# Altium schematic sheet P16 System RST.SchDoc
size 420 x 297 mm
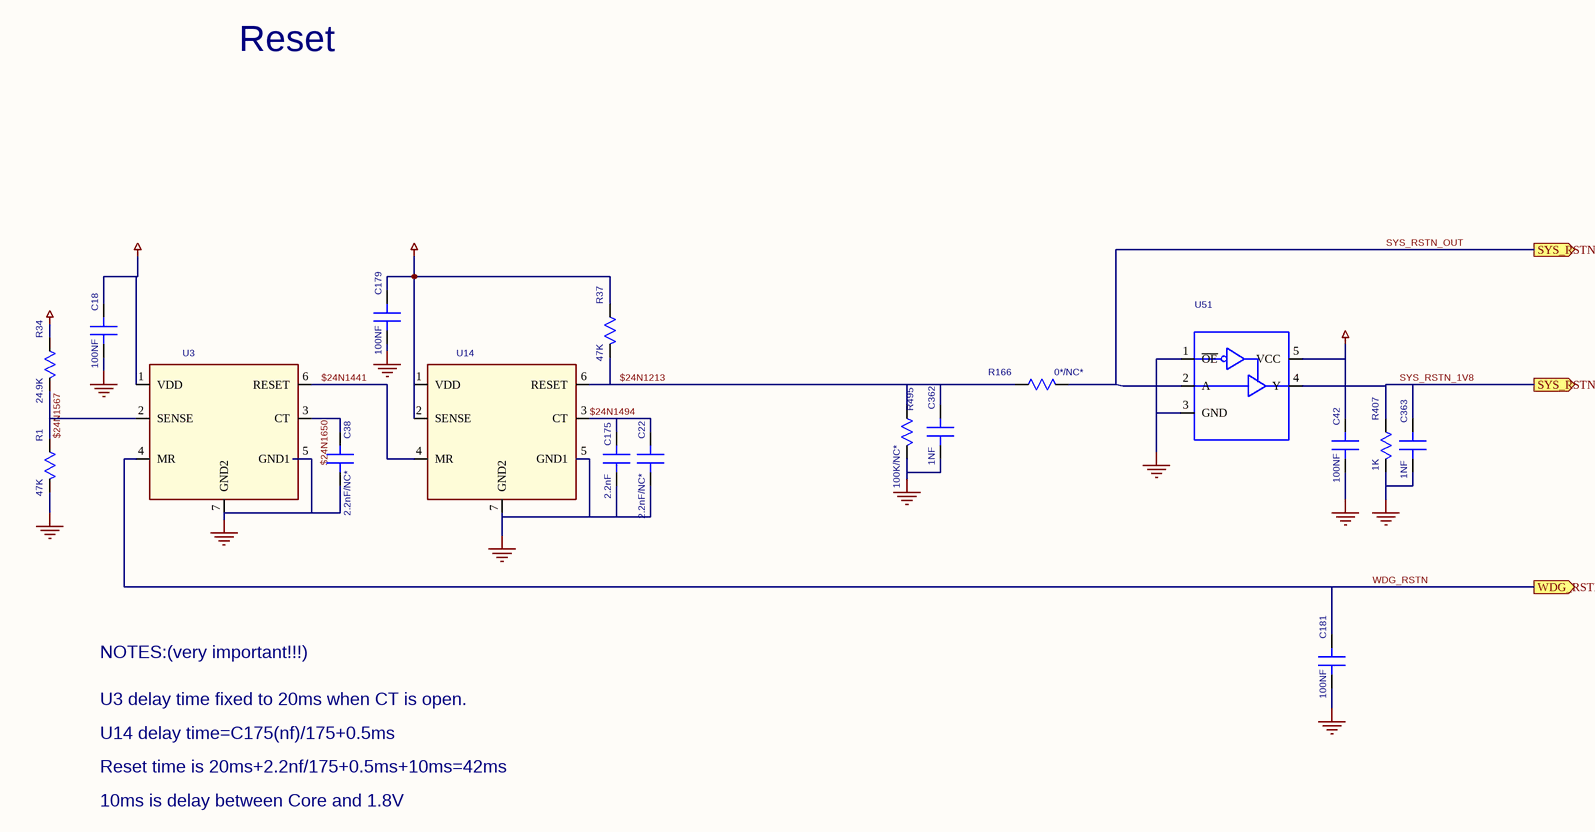
[diagram p0: P16 System RST.SchDoc]

## Parts
C18  100NF  [SC0402]
C22  2.2nF/NC*  [SC0402]
C38  2.2nF/NC*  [SC0402]
C42  100NF  [SC0402]
C175  2.2nF  [SC0402]
C179  100NF  [SC0402]
C181  100NF  [SC0402]
C362  1NF  [SC0402]
C363  1NF  [SC0402]
R1  47K  [SR0402]
R34  24.9K  [SR0402]
R37  47K  [SR0402]
R166  0*/NC*  [SR0402]
R407  1K  [SR0402]
R495  100K/NC*  [SR0402]
U3  *  [WDFN6-0R65-2X2-H1R6X1R00]  (value not drawn)
U14  *  [WDFN6-0R65-2X2-H1R6X1R00]  (value not drawn)
U51  SN74LVC1G125Q-Q1  [HSOT-SC70-DCK]  (value not drawn)

## Ports
SYS_RSTN_1V8, SYS_RSTN_OUT (out), WDG_RSTN (out)

## Nets
1V8: C18.1(A) C42.1(A) C179.1(A) R37.1(A) U3.1(VDD) U14.1(VDD) U14.2(SENSE) U51.5(VCC)
DVDD: R34.1(A)
GND: C18.2(B) C22.2(B) C38.2(B) C42.2(B) C175.2(B) C179.2(B) C181.2(B) C362.2(B) C363.2(B) R1.2(B) R407.2(B) R495.2(B) U3.5(GND1) U3.7(GND2) U14.5(GND1) U14.7(GND2) U51.1(~{OE}) U51.3(GND)
$24N1213: C362.1(A) R37.2(B) R166.1(A) R495.1(A) U14.6(RESET)
$24N1441: U3.6(RESET) U14.4(MR)
$24N1494: C22.1(A) C175.1(A) U14.3(CT)
$24N1567: R1.1(A) R34.2(B) U3.2(SENSE)
$24N1650: C38.1(A) U3.3(CT)
SYS_RSTN_1V8: C363.1(A) R407.1(A) U51.4(Y) ; port SYS_RSTN_1V8
SYS_RSTN_OUT: R166.2(B) U51.2(A) ; port SYS_RSTN_OUT
WDG_RSTN: C181.1(A) U3.4(MR) ; port WDG_RSTN

## Notes on the sheet
- Reset
- U3 delay time fixed to 20ms when CT is open.
- NOTES:(very important!!!)
- Reset time is 20ms+2.2nf/175+0.5ms+10ms=42ms
- U14 delay time=C175(nf)/175+0.5ms
- 10ms is delay between Core and 1.8V

## Library data of the parts
C18 C42 = C: PARTS: 1; OriginalSymbolOrigin: (0,0); DEVICE: RMEMK105BJ104KV_FR; LEVEL: STD; PINSWAP: (A,B); %182%%238%%182%%168%%185%%164%%215%%247%%181%%231%%209%%185%(V): 16; COMPONENT_HIGH_MAX: 0.55MM; CODE: 8070614; %195%%232%%202%%246%: SMD陶瓷电容-16V-100NF-+/-10%-X7R-0402-BT; %208%%161%%192%%224%%195%%251%%179%%198%: SMD陶瓷电容; PKG_TYPE: SC0402
C22 = C: PARTS: 1; OriginalSymbolOrigin: (0,0); DEVICE: C0402C222K5RAC_7867; LEVEL: STD; PINSWAP: (A,B); CODE: 8070924; %195%%232%%202%%246%: SMD陶瓷电容-50V-2.2nF-+/-10%-X7R-0402-供电专用-08070557拆分-供电专用; %182%%238%%182%%168%%185%%164%%215%%247%%181%%231%%209%%185%(V): 50; COMPONENT_HIGH_MAX: 0.55mm; %208%%161%%192%%224%%195%%251%%179%%198%: SMD陶瓷电容; VARIANT_ID: $24I1610; PKG_TYPE: SC0402
C38 = C: PARTS: 1; OriginalSymbolOrigin: (0,0); DEVICE: C0402C222K5RAC_7867; LEVEL: STD; PINSWAP: (A,B); CODE: 8070924; %195%%232%%202%%246%: SMD陶瓷电容-50V-2.2nF-+/-10%-X7R-0402-供电专用-08070557拆分-供电专用; %182%%238%%182%%168%%185%%164%%215%%247%%181%%231%%209%%185%(V): 50; COMPONENT_HIGH_MAX: 0.55mm; %208%%161%%192%%224%%195%%251%%179%%198%: SMD陶瓷电容; VARIANT_ID: $24I1651; PKG_TYPE: SC0402
C175 = C: PARTS: 1; OriginalSymbolOrigin: (0,0); DEVICE: C0402C222K5RAC_7867; LEVEL: STD; PINSWAP: (A,B); %208%%161%%192%%224%%195%%251%%179%%198%: SMD陶瓷电容; COMPONENT_HIGH_MAX: 0.55mm; %182%%238%%182%%168%%185%%164%%215%%247%%181%%231%%209%%185%(V): 50; %195%%232%%202%%246%: SMD陶瓷电容-50V-2.2nF-+/-10%-X7R-0402-供电专用-08070557拆分-供电专用; CODE: 8070924; PKG_TYPE: SC0402
C179 = C: PARTS: 1; OriginalSymbolOrigin: (0,0); DEVICE: RMEMK105BJ104KV_FR; LEVEL: STD; PINSWAP: (A,B); %208%%161%%192%%224%%195%%251%%179%%198%: SMD陶瓷电容; %195%%232%%202%%246%: SMD陶瓷电容-16V-100NF-+/-10%-X7R-0402-BT; CODE: 8070614; COMPONENT_HIGH_MAX: 0.55MM; %182%%238%%182%%168%%185%%164%%215%%247%%181%%231%%209%%185%(V): 16; PKG_TYPE: SC0402
C181 = C: PARTS: 1; OriginalSymbolOrigin: (0,0); DEVICE: RMEMK105BJ104KV_FR; LEVEL: STD; PINSWAP: (A,B); %208%%161%%192%%224%%195%%251%%179%%198%: SMD陶瓷电容; %195%%232%%202%%246%: SMD陶瓷电容-16V-100NF-+/-10%-X7R-0402-BT; CODE: 8070614; %182%%238%%182%%168%%185%%164%%215%%247%%181%%231%%209%%185%(V): 16; COMPONENT_HIGH_MAX: 0.55MM; PKG_TYPE: SC0402
C362 = C: PARTS: 1; OriginalSymbolOrigin: (0,0); DEVICE: 04025C102KAT2A; LEVEL: STD; PINSWAP: (A,B); %208%%161%%192%%224%%195%%251%%179%%198%: SMD陶瓷电容; %195%%232%%202%%246%: SMD陶瓷电容-50V-1nF-+/-10%-X7R-0402-BT; CODE: 8070531; COMPONENT_HIGH_MAX: 0.56MM; %182%%238%%182%%168%%185%%164%%215%%247%%181%%231%%209%%185%(V): 50; PKG_TYPE: SC0402
C363 = C: PARTS: 1; OriginalSymbolOrigin: (0,0); DEVICE: 04025C102KAT2A; LEVEL: STD; PINSWAP: (A,B); %182%%238%%182%%168%%185%%164%%215%%247%%181%%231%%209%%185%(V): 50; COMPONENT_HIGH_MAX: 0.56MM; CODE: 8070531; %195%%232%%202%%246%: SMD陶瓷电容-50V-1nF-+/-10%-X7R-0402-BT; %208%%161%%192%%224%%195%%251%%179%%198%: SMD陶瓷电容; PKG_TYPE: SC0402
R1 = R_Dup1: PARTS: 1; OriginalSymbolOrigin: (0,0); PINSWAP: (A,B); DEVICE: RK73H1ELTP4702F; LEVEL: STD; CODE: 7090829; %195%%232%%202%%246%: 片式厚膜电阻器-0.0625W-47000ohm-+/-1%-0402; %182%%238%%182%%168%%185%%166%%194%%202%(W): 0.06; %215%%232%%214%%181%%212%%202%%208%%237%%198%%171%%178%%238%: +/-1%; COMPONENT_HIGH_MAX: 0.4MM; %208%%161%%192%%224%%195%%251%%179%%198%: 片式厚膜电阻器; PKG_TYPE: SR0402
R34 = R_Dup1: PARTS: 1; OriginalSymbolOrigin: (0,0); PINSWAP: (A,B); DEVICE: RC_02W2492FT; LEVEL: STD; CODE: 7091377; %195%%232%%202%%246%: 片式厚膜电阻器-0.0625W-24900ohm-+/-1%-0402; %182%%238%%182%%168%%185%%166%%194%%202%(W): 0.06; %215%%232%%214%%181%%212%%202%%208%%237%%198%%171%%178%%238%: +/-1%; COMPONENT_HIGH_MAX: 0.4mm; %208%%161%%192%%224%%195%%251%%179%%198%: 片式厚膜电阻器; PKG_TYPE: SR0402
R37 = R_Dup1: PARTS: 1; OriginalSymbolOrigin: (0,0); PINSWAP: (A,B); DEVICE: RC0402FR_0747KL; LEVEL: STD; CODE: 7091621; %195%%232%%202%%246%: 片式厚膜电阻器-0.0625W-47000ohm-+/-1%-0402--供电专用 07090829-供电专用; %182%%238%%182%%168%%185%%166%%194%%202%(W): 0.06; %215%%232%%214%%181%%212%%202%%208%%237%%198%%171%%178%%238%: +/-1%; COMPONENT_HIGH_MAX: 0.4MM; %208%%161%%192%%224%%195%%251%%179%%198%: 片式厚膜电阻器; PKG_TYPE: SR0402
R166 = R_Dup1: PARTS: 1; OriginalSymbolOrigin: (0,0); PINSWAP: (A,B); DEVICE: RC0402JR_070R; LEVEL: STD; VARIANT_ID: $24I1229; COMPONENT_HIGH_MAX: 0.4MM; CODE: 7090800; %195%%232%%202%%246%: 片式厚膜电阻器-0.0625W-0ohm-< 50mohm-0402-1A-BT; %208%%161%%192%%224%%195%%251%%179%%198%: 片式厚膜电阻器; PKG_TYPE: SR0402
R407 = R_Dup1: PARTS: 1; OriginalSymbolOrigin: (0,0); PINSWAP: (A,B); DEVICE: RC0402FR_071KL; LEVEL: STD; %208%%161%%192%%224%%195%%251%%179%%198%: 片式厚膜电阻器; %195%%232%%202%%246%: 片式厚膜电阻器-0.0625W-1000ohm-+/-1%-0402-BT; CODE: 7091282; COMPONENT_HIGH_MAX: 0.4MM; PKG_TYPE: SR0402
R495 = R_Dup1: PARTS: 1; OriginalSymbolOrigin: (0,0); PINSWAP: (A,B); DEVICE: RK73H1ETTP1003F; LEVEL: STD; VARIANT_ID: $24I871; COMPONENT_HIGH_MAX: 0.4MM; CODE: 7090875; %195%%232%%202%%246%: 片式厚膜电阻器-0.0625W-100000ohm-+/-1%-0402; %208%%161%%192%%224%%195%%251%%179%%198%: 片式厚膜电阻器; PKG_TYPE: SR0402
U3 = NCP308_2: PARTS: 1; OriginalSymbolOrigin: (0,0); LEVEL: STD; HETERO: NCP308; DEVICE: NCP308MTADJTBG; VARIANT_ID: $24I1419; CODE: HBVT4057; PKG_TYPE: WDFN6-0R65-2X2-H1R6X1R00
U14 = NCP308_2: PARTS: 1; OriginalSymbolOrigin: (0,0); LEVEL: STD; HETERO: NCP308; DEVICE: NCP308MT180TBG; VARIANT_ID: $24I1432; CODE: HBVT4058; PKG_TYPE: WDFN6-0R65-2X2-H1R6X1R00
U51 = SN74LVC1G125Q-Q1_0: PARTS: 1; OriginalSymbolOrigin: (0,0); CODE: 36020340; LEVEL: STD; DEVICE: SN74LVC1G125DCKR; COMPONENT_HIGH_MAX: 1.1MM; %195%%232%%202%%246%: CMOS-CMOS驱动器-SC70-5.3ns-24mA-CMOS-CMOS; %208%%161%%192%%224%%195%%251%%179%%198%: CMOS; PKG_TYPE: HSOT-SC70-DCK